# EAGLE design Lumen-Driver-X2 (EAGLE 7.4.0)
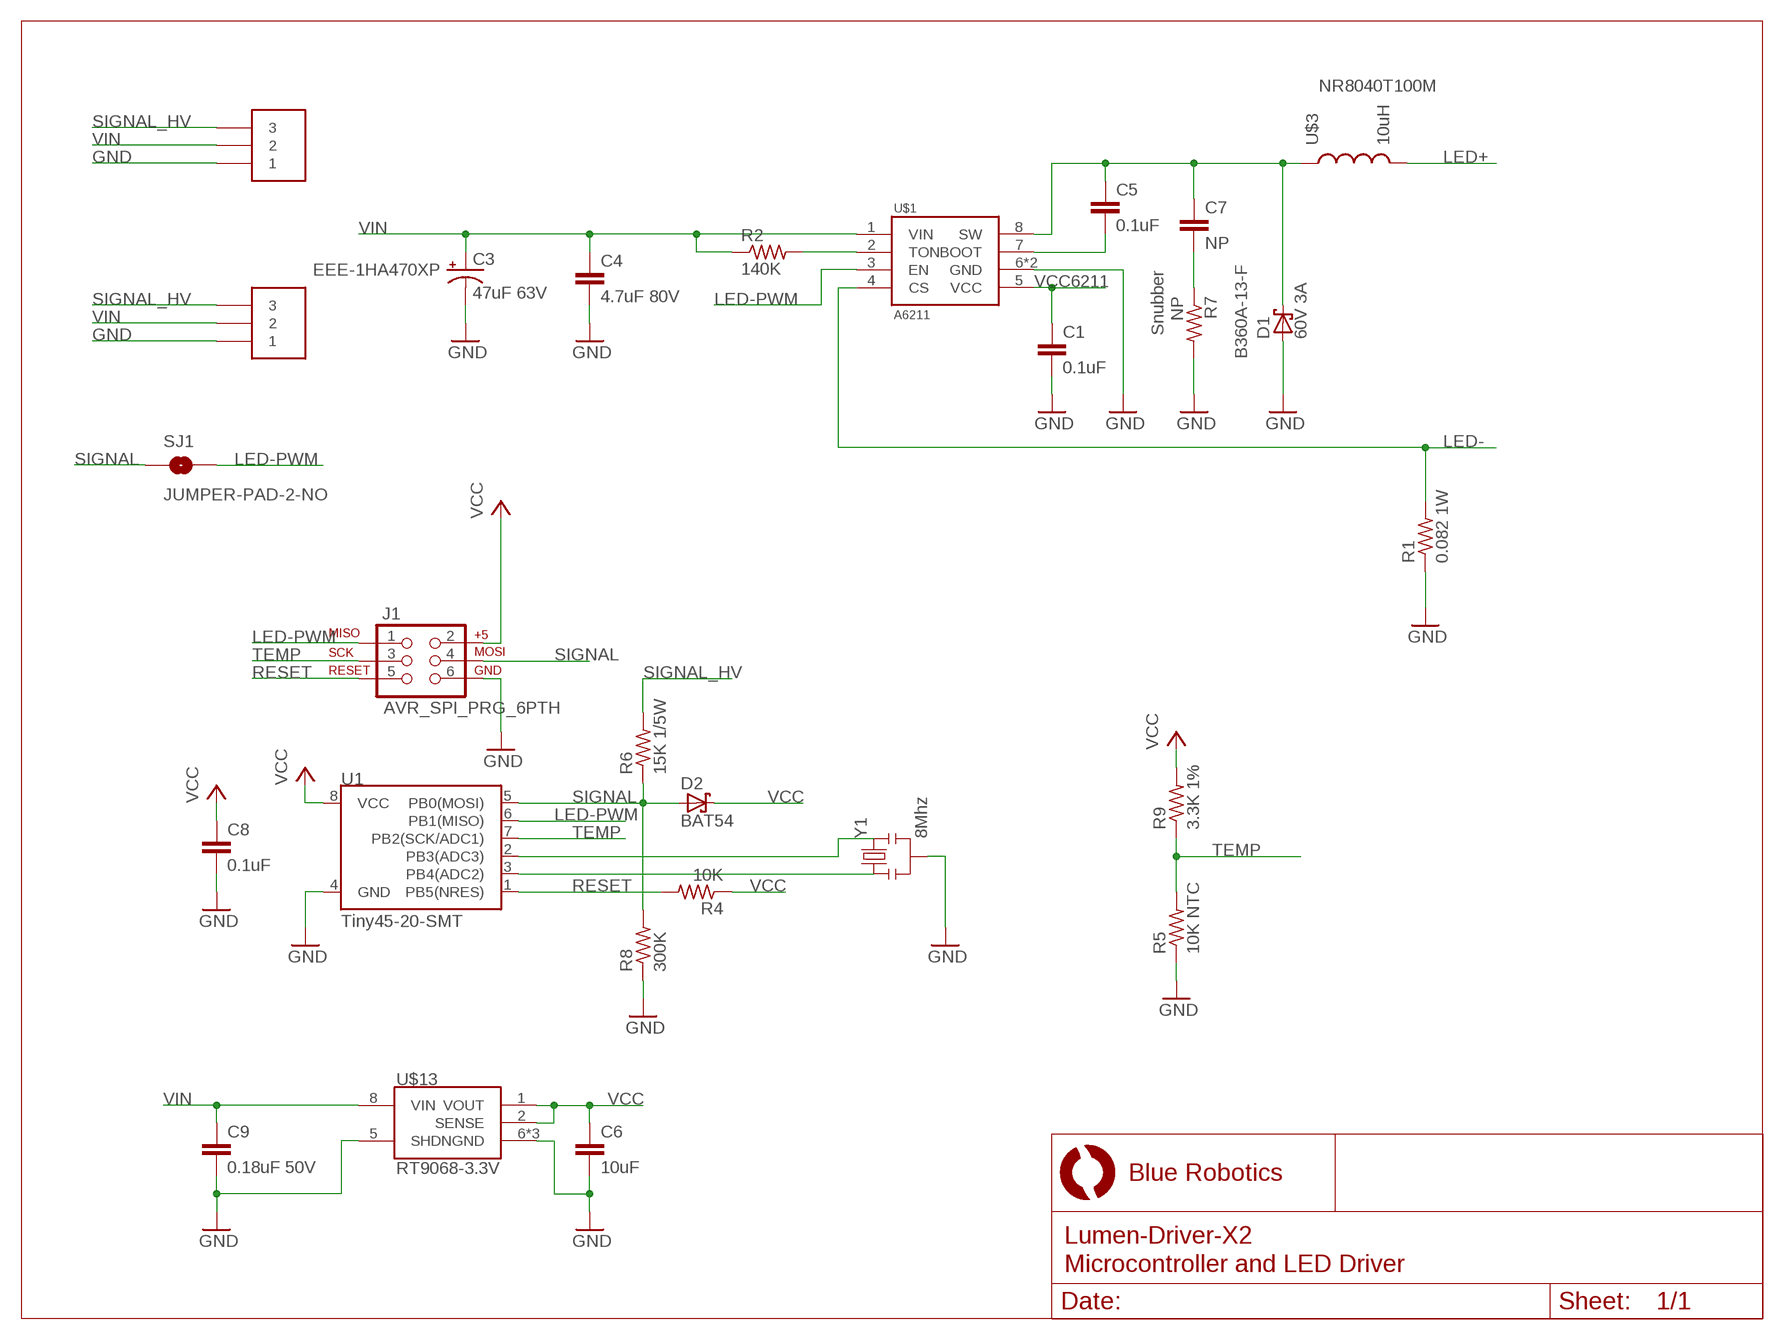
[diagram p0: schematic, sheet 1]

## Parts
C1  0.1uF  CAPACITOR_0402  [C0402]
C3  47uF 63V  CAP_POLD  [PANASONIC_D]
C4  4.7uF 80V  C-EUC1210  [C1210]
C5  0.1uF  CAPACITOR_0402  [C0402]
C6  10uF  C-EUC0603  [C0603]
C7  NP  C-EUC0603  [C0603]
C8  0.1uF  CAPACITOR_0402  [C0402]
C9  0.18uF 50V  C-EUC0805  [C0805]
D1  60V 3A  DIODE-SCHOTTKYSMA  [SMA]
D2  BAT54  DIODE-SCHOTTKYSOD523  [SOD523]
J1  AVR_SPI_PRG_6PTH  [2X3]
R1  0.082 1W  R-US_R2512  [R2512]
R2  140K  RESISTOR_0402  [R0402]
R4  10K  RESISTOR_0402  [R0402]
R5  10K NTC  R-US_R0603  [R0603]
R6  15K 1/5W  RESISTOR_0402  [R0402]
R7  NP  R-US_R1206  [R1206]
R8  300K  RESISTOR_0402  [R0402]
R9  3.3K 1%  RESISTOR_0402  [R0402]
SJ1  JUMPER-PAD-2-NO  [PAD-JUMPER-2-NO_NO_SILK]
U1  Tiny45-20-SMT  ATTINY45TINY45-20-SMT  [SO08-EIAJ]
U$1  A6211  [SOIC8N-LJ]
U$3  10uH  INDUCTOR8040  [INDUCTOR-8040]
U$11  009176003032006  HEADER-3AVX-9176  [AVX-9176-3POS]
U$12  009176003032006  HEADER-3AVX-9176  [AVX-9176-3POS]
U$13  RT9068-3.3V  VREG-RT9068SOP-8  [SOIC8N-LJ]
Y1  8Mhz  RESONATORSMD  [RESONATOR-SMD]

## Nets
GND: C1.2 C3.- C4.2 C6.2 C8.2 C9.2 D1.A J1.6 R1.1 R5.1 R7.2 R8.1 U1.4(GND) U$1.6(GND) U$1.PAD(GND) U$11.1 U$12.1 U$13.5(SHDN) U$13.6(GND) U$13.7(GND) U$13.PAD(GND) Y1.2
LED+: U$3.P$2
LED-: R1.2 U$1.4(CS)
LED-PWM: J1.1 SJ1.2 U1.6(PB1(MISO)) U$1.3(EN)
N$1: R2.2 U$1.2(TON)
N$2: C7.2 R7.1
N$4: C5.2 U$1.7(BOOT)
N$5: C5.1 C7.1 D1.C U$1.8(SW) U$3.P$1
N$6: U1.3(PB4(ADC2)) Y1.1
N$7: U1.2(PB3(ADC3)) Y1.3
RESET: J1.5 R4.2 U1.1(PB5(NRES))
SIGNAL: D2.A J1.4 R6.1 R8.2 SJ1.1 U1.5(PB0(MOSI))
SIGNAL_HV: R6.2 U$11.3 U$12.3
TEMP: J1.3 R5.2 R9.1 U1.7(PB2(SCK/ADC1))
VCC: C6.1 C8.1 D2.C J1.2 R4.1 R9.2 U1.8(VCC) U$13.1(VOUT) U$13.2(SENSE)
VCC6211: C1.1 U$1.5(VCC)
VIN: C3.+ C4.1 C9.1 R2.1 U$1.1(VIN) U$11.2 U$12.2 U$13.8(VIN)

## Notes on the sheet
- NR8040T100M
- EEE-1HA470XP
- Snubber
- B360A-13-F

## Library data of the parts
C1 C5 C8 = BlueRobotics-Main:CAPACITOR
C3 = SparkFun-Capacitors:CAP_POL: Capacitor Polarized These are standard SMD and PTH capacitors. Normally 10uF, 47uF, and 100uF in electrolytic and tantalum varieties. Always verify the external diameter of the through hole cap, it varies with capacity, voltage, and manufacturer. The EIA devices should be standard.
C4 C6 C7 C9 = resistor:C-EU: CAPACITOR, European symbol
D1 D2 = BlueRobotics-Main:DIODE-SCHOTTKY
J1 = SparkFun-Connectors:AVR_SPI_PRG_6: AVR ISP 6 Pin This is the reduced ISP connector for AVR programming. Common on Arduino. This footprint will take up less PCB space and can be used with a 10-pin to 6-pin adapter such as SKU: BOB-08508 **Special note about "TEST_POINT" package. The stop mask is on the top side, so if you want your programming test points to be on the bottom of your board, make sure to place this package on the bottom side of the board. This also ensure that the orientation to program from the bottom side will be correct.
R1 R5 R7 = resistor:R-US_: RESISTOR, American symbol
R2 R4 R6 R8 R9 = BlueRobotics-Main:RESISTOR
SJ1 = SparkFun-Passives:JUMPER-PAD-2-NO
U1 = SparkFun-DigitalIC:ATTINY45: Atmel 8-pin 2/4/8kB flash uC; PROD_ID: IC-08922
U$1 = BlueRobotics-Main:A6211
U$3 = BlueRobotics-Main:INDUCTOR
U$11 U$12 = BlueRobotics-Main:HEADER-3
U$13 = BlueRobotics-Main:VREG-RT9068: RT9068 60V to 3.3V Regulator, 50mA
Y1 = SparkFun:RESONATOR: Resonator Small SMD resonator. This is the itty bitty 10/20MHz resonators with built in caps. CSTCE10M0G55 and CSTCE20M0V53. Footprint has been reviewed closely but hasn't been tested yet.

## Board
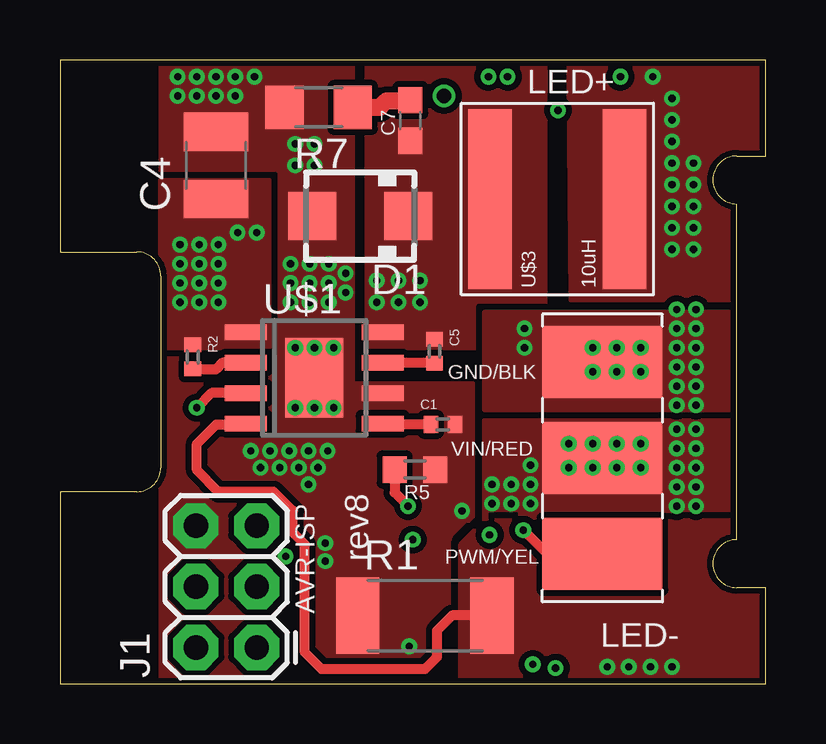
[diagram p1: board, top side]
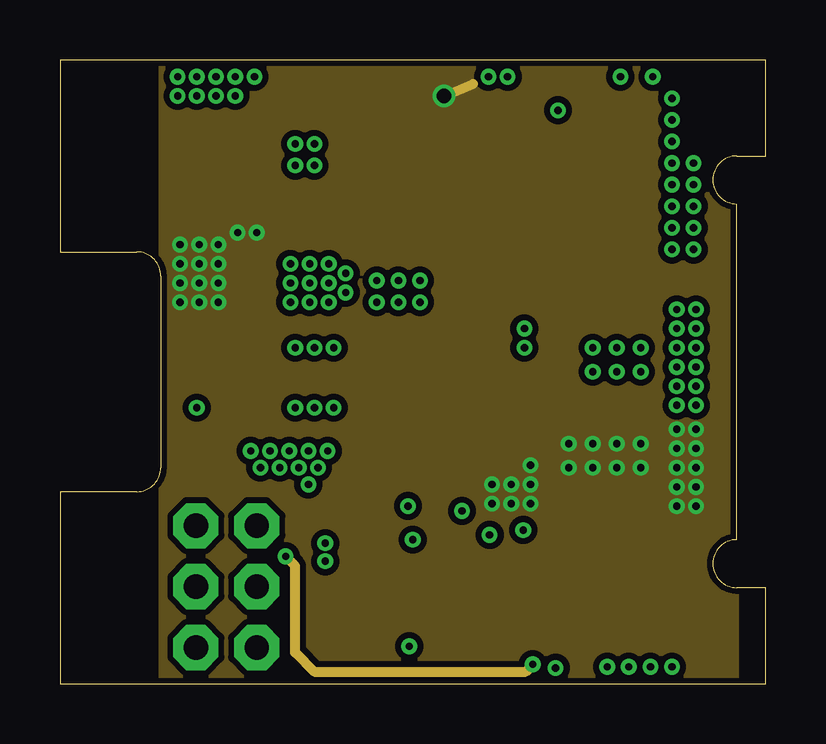
[diagram p2: board, inner layer Route2]
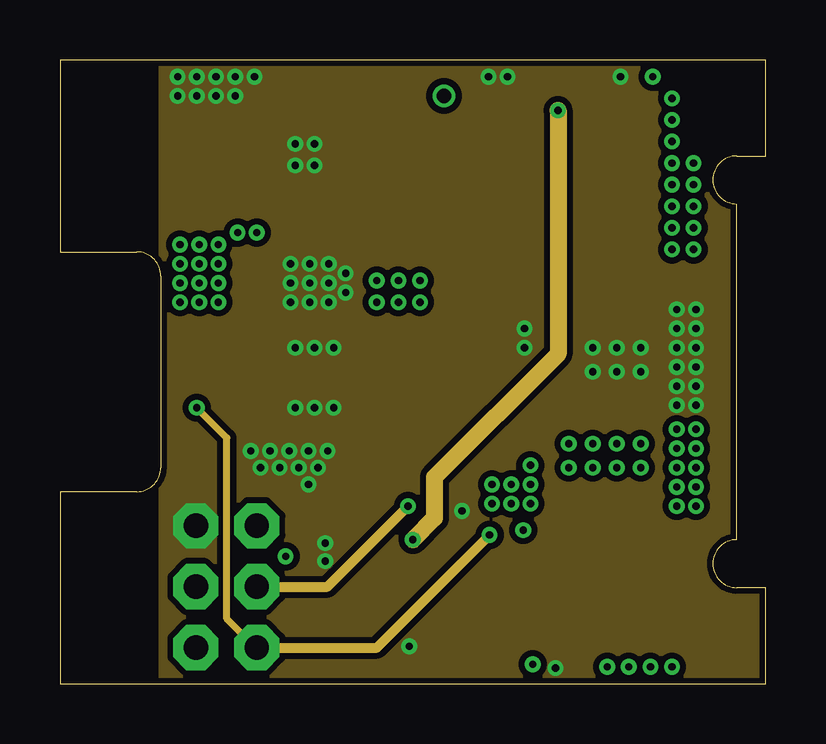
[diagram p3: board, inner layer Route15]
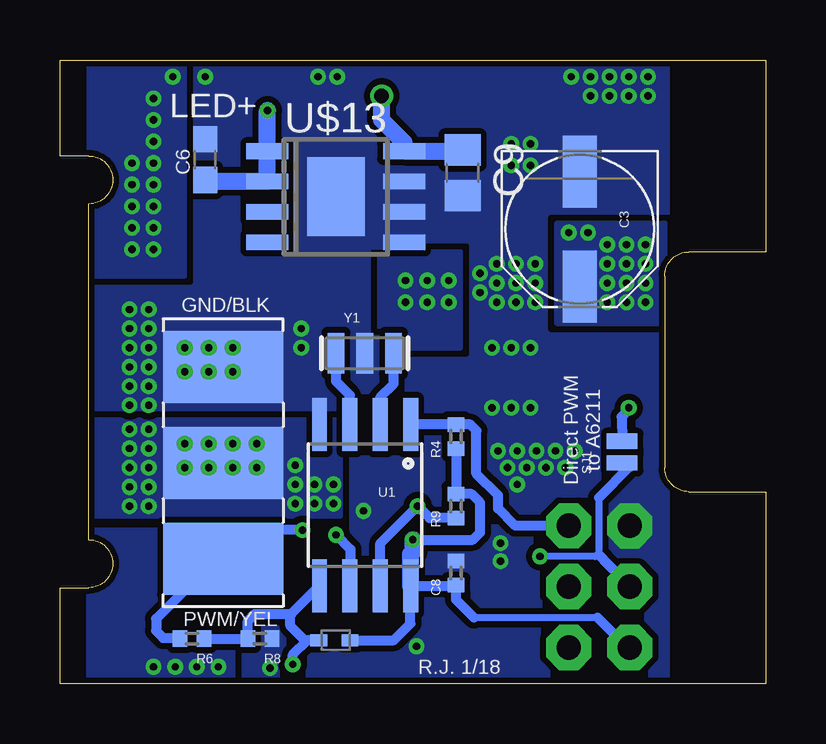
[diagram p4: board, bottom side, seen from below]

Size 29.4 x 26 mm. Coordinates in mm from the lower left corner, seen from the top.
Outline: 29.4,26 0,26 0,18 3.2,18 arc-90 4.2,17 4.2,9 arc-90 3.2,8 0,8 0,0 29.4,0 29.4,4 28.2,4 arc-180 28.2,6 28.2,20 arc-180 28.2,22 29.4,22 29.4,26
Copper layers (1*2+15*16): Top 0.0356mm / dielectric 1.5011mm / Route2 0.0356mm / dielectric 0.1499mm / Route15 0.0356mm / dielectric 0.2007mm / Bottom 0.0356mm
Design rules "OSHPark *": minimum track width 6mil, minimum drill 10mil, track to track 6mil, track to pad 6mil, pad to pad 6mil, via to via 6mil, smd to smd 6mil, copper to edge 10mil, drill to drill 6mil, minimum pad ring 7mil, minimum via ring 7mil, stop-mask expansion 3mil, vias tented up to drill 30mil, thermal gap 10mil

### Footprints (pad centres in the part's own frame; a part is rotated, then mirrored left to right if it is on the bottom)
C0402 = smd 0.6 x 0.7: 1 -0.5,0; 2 0.5,0
PANASONIC_D = smd 3 x 1.4: + 2.4,0; - -2.4,0
C1210 = smd 1.6 x 2.7: 1 -1.4,0; 2 1.4,0
C0603 = smd 1.1 x 1: 1 -0.85,0; 2 0.85,0
C0805 = smd 1.3 x 1.5: 1 -0.95,0; 2 0.95,0
SMA = smd 2 x 2: A 2,0; C -2,0
SOD523 = smd 0.7 x 0.5: A 0.7,0; C -0.6,0
2X3 = drill 1.016 pad 1.88 octagon: 1 0,0; 2 0,2.54; 3 2.54,0; 4 2.54,2.54; 5 5.08,0; 6 5.08,2.54
R2512 = smd 1.8 x 3.2: 1 -2.8,0; 2 2.8,0
R0402 = smd 0.6 x 0.7: 1 -0.5,0; 2 0.5,0
R0603 = smd 1 x 1.1: 1 -0.85,0; 2 0.85,0
R1206 = smd 1.6 x 1.803: 1 -1.422,0; 2 1.422,0
PAD-JUMPER-2-NO_NO_SILK = smd 0.635 x 1.27: 1 -0.45,0; 2 0.45,0
SO08-EIAJ = smd 0.61 x 2.21: 1 -1.905,-3.378; 2 -0.635,-3.378; 3 0.635,-3.378; 4 1.905,-3.378; 5 1.905,3.353; 6 0.635,3.353; 7 -0.635,3.353; 8 -1.905,3.353
SOIC8N-LJ = smd 0.65 x 1.75: 1 -1.9,-2.86; 2 -0.63,-2.86; 3 0.64,-2.86; 4 1.91,-2.86; 5 1.91,2.84; 6 0.64,2.84; 7 -0.63,2.84; 8 -1.9,2.84 | smd 3.3 x 2.41: PAD 0,0
INDUCTOR-8040 = smd 1.8 x 7.5: P$1 -2.8,0; P$2 2.8,0
AVX-9176-3POS = smd 3 x 5: 1 0,0; 2 4,0; 3 8,0
RESONATOR-SMD = smd 0.7 x 1.7: 1 -1.2,0; 2 0,0; 3 1.2,0

### Placement (x,y rotation side)
C1  15.95,10.8 0 top
C3  7.74,18.95 270 bottom
C4  6.5,21.6 90 top
C5  15.6,13.85 270 top
C6  23.35,21.85 90 bottom
C7  14.6,23.48 90 top
C8  12.9,4.6 90 bottom
C9  12.62,21.3 270 bottom
D1  12.51,19.49 180 top
D2  17.91,1.81 180 bottom
J1  8.2,1.5 90 top
R1  15.2,2.83 0 top
R2  5.53,13.62 270 top
R4  12.9,10.3 90 bottom
R5  14.79,8.93 180 top
R6  23.9,1.88 180 bottom
R7  10.78,24.02 180 top
R8  21.07,1.88 180 bottom
R9  12.9,7.4 90 bottom
SJ1  5.97,9.65 90 bottom
U1  16.69,7.42 180 bottom
U$1  10.6,12.75 270 top
U$3  20.72,20.2 0 top
U$11  22.6,13.4 270 top
U$12  22.6,13.2 270 bottom
U$13  17.9,20.3 270 bottom
Y1  16.7,13.78 0 bottom

### Tracks (layer width: path | path; a pad name or v marks a point on that pad's centre or on a via)
GND  (via drill 0.3)
  other vias: 9.6,15.9 25.7,11.6 26.5,11.6 26.5,12.4 26.5,13.2 26.5,14 26.5,14.8 26.5,15.6 25.7,12.4 25.7,13.2 25.7,14 25.7,14.8 25.7,15.6 4.9,25.3 5.7,25.3 6.5,25.3 7.3,25.3 8.1,25.3 4.9,24.5 5.7,24.5 6.5,24.5 7.3,24.5 9.8,22.5 10.6,22.5 10.6,21.6 9.8,21.6 9.6,16.7 9.6,17.5 10.4,17.5 11.2,17.5 10.4,16.7 10.4,15.9 11.2,15.9 11.2,16.7 11.9,17.1 11.9,16.3 9.55,9.7 9.8,14 11.4,14 10.6,14 11.4,11.5 10.6,11.5 9.8,11.5 10.35,9.7 11.15,9.7 9.95,9 10.75,9 11.05,5.1 10.35,8.3 11.05,5.85 8.75,9.7 7.95,9.7 9.15,9 8.35,9 20.65,0.65 19.35,14.8 19.35,14 17.85,25.3 23.35,25.3 22.2,13 22.2,14 23.2,14 24.2,14 24.2,13 23.2,13 18.65,25.3 16.75,7.2 14.55,1.55
  pour Top (isolate 0.254, rank 6, no thermals): 4.2,27 4.2,-1 16.2,-1 16.2,6 17.2,7 17.2,12.5 12.2,12.5 12.2,27
  pour Top (isolate 0.254, no thermals): 17.7,11.4 17.7,15.5 28.2,15.5 28.2,11.4
  pour Bottom (isolate 0.254, rank 6, no thermals): 4.2,-1 28.2,-1 28.2,27 4.2,27
  pour Route15 (isolate 0.254, rank 6, no thermals): 4.2,-1 29.2,-1 29.2,27 4.2,27
LED+  (via drill 0.3)
  other vias: 24.7,25.3 26.4,21.7 26.4,20.8 26.4,19.9 26.4,19 26.4,18.1 25.5,18.1 25.5,19 25.5,19.9 25.5,20.8 25.5,21.7 25.5,22.6 25.5,23.5 25.5,24.4
  pour Top (isolate 0.254, no thermals): 21.3,16 21.2,27 31.2,27 31.2,16
  pour Bottom (isolate 0.254, no thermals): 24.2,27 28.2,27 28.2,17 24.2,17
LED-  (via drill 0.3)
  Top 0.406: R1.2 16.34,2.83 15.7,2.2 15.7,1.1 15.2,0.6 10.9,0.6 10.2,1.3 10.2,5.8 9.7,6.3 9.7,7.2 8.9,8 6.6,8 5.7,8.9 5.7,10 6.5,10.8 7.7,10.8 U$1.4
  other vias: 22.8,0.7 23.7,0.7 24.6,0.7 25.5,0.7
  pour Top (isolate 0.254, no thermals): 17.7,6.8 31.2,6.8 31.2,-1 16.7,-1 16.7,5.8
  pour Bottom (isolate 0.254, no thermals): 22.2,-1 28.2,-1 28.2,6.4 22.2,6.4
LED-PWM  (via drill 0.3)
  Top 0.406: U$1.3 6.31,12.11 v5.7,11.5
  Route15 0.3: J1.1 8.15,1.5 6.95,2.7 6.95,10.25 v5.7,11.5
  Route15 0.406: J1.1 13.2,1.5 v17.9,6.2
  Bottom 0.406: v17.9,6.2 17.3,5.6 17.3,4.09 U1.6 | v5.7,11.5 6,11.12 SJ1.2
N$1
  Top 0.406: U$1.2 6.78,13.38 6.5,13.1 5.66,13.1 R2.2
N$2
  Top 0.7: R7.1 13.32,24.02 13.6,24.3 14.57,24.3 C7.2
N$4
  Top 0.406: U$1.7 15.6,13.38 C5.2
N$5  (via drill 0.3)
  other vias: 13.2,15.9 13.2,16.8 14.1,16.8 15,16.8 14.1,15.9 15,15.9
  pour Top (isolate 0.254, rank 2, no thermals): 12.8,14 12.8,27 20.2,27 20.2,14
  pour Bottom (isolate 0.254, no thermals): 12.7,14 12.7,18 16.1,18 16.1,14
N$6
  Bottom 0.406: U1.3 17.32,12.03 17.9,12.6 Y1.1
N$7
  Bottom 0.406: U1.2 16.05,11.95 15.5,12.5 Y1.3
RESET
  Bottom 0.406: J1.5 10.43,6.58 11.15,7.3 11.15,7.85 12.05,8.75 12.05,10.55 12.3,10.8 R4.2 U1.1
SIGNAL  (via drill 0.3)
  Route2 0.406: v19.7,0.8 19.4,0.5 10.6,0.5 9.8,1.3 9.8,4.9 v9.4,5.3
  Bottom 0.3: 6.95,7.75 6.95,5.38 7.02,5.38 7.1,5.3 v9.4,5.3
  Bottom 0.406: R6.1 R8.2 21.57,2.62 21.3,2.9 19.76,2.9 | 19.76,2.9 U1.5 | D2.A 19.1,1.81 | 19.1,1.81 19.21,1.81 19.8,2.4 19.8,2.86 19.76,2.9 | SJ1.1 5.67,9.03 6.95,7.75 | 6.95,5.38 J1.4 | v19.7,0.8 19.7,1.21 19.1,1.81
SIGNAL_HV  (via drill 0.3)
  Top 0.406: U$11.3 20.3,5.4 v19.3,6.4
  Bottom 0.406: v19.3,6.4 21.4,6.4 U$12.3 22.9,5.2 25.4,2.7 25.4,2.2 25.1,1.9 24.43,1.9 R6.2
TEMP  (via drill 0.3)
  Top 0.406: R5.2 13.94,7.96 v14.5,7.4
  Route15 0.406: J1.3 11.14,4.04 v14.5,7.4
  Bottom 0.406: R9.1 14,6.9 v14.5,7.4 16.05,5.84 U1.7
VCC  (via drill 0.3)
  Route15 0.7: v20.75,23.9 20.75,13.75 15.6,8.6 15.6,6.9 v14.7,6
  Bottom 0.3: J1.2 5.75,1.5 | 7,2.75 12.15,2.75
  Bottom 0.406: R4.1 R9.2 12.25,7.9 11.9,7.55 11.9,6.3 12.2,6 v14.7,6 | D2.C 15.49,1.81 14.8,2.5 14.8,4.05 U1.8 12.93,4.07 C8.1 12.9,3.5 12.15,2.75 | 5.75,1.5 7,2.75
  Bottom 0.7: U$13.2 23.48,20.93 C6.1 | U$13.2 U$13.1 | U$13.2 v20.76,23.89 v20.75,23.9 | v14.7,6 14.7,5.5 14.8,5.4 14.8,4.08 U1.8
VCC6211
  Top 0.406: C1.1 13.48,10.8 U$1.5
VIN  (via drill 0.3, 0.6)
  Route2 0.406: v16,24.5 17.2,25
  Bottom 0.7: 16,24.6 v16,24.5 16,23.5 15.06,22.56 U$13.8 12.78,22.2 C9.1
  other vias: 25.7,10.6 25.7,9.8 25.7,9 25.7,8.2 25.7,7.4 26.5,7.4 26.5,8.2 26.5,9 26.5,9.8 26.5,10.6 5,15.9 5,16.7 5,17.5 5.8,15.9 6.6,15.9 6.6,18.3 6.6,16.7 5.8,16.7 5.8,17.5 6.6,17.5 5,18.3 5.8,18.3 19.6,7.5 19.6,8.3 18.8,8.3 18.8,7.5 18,7.5 18,8.3 19.6,9.1 21.2,10 21.2,9 22.2,9 23.2,9 24.2,9 24.2,10 23.2,10 22.2,10 7.4,18.8 8.2,18.8
  pour Top (isolate 0.254, no thermals): 4.2,21 8.7,21 8.7,14 4.2,14
  pour Route2 (isolate 0.254, no thermals): 28.2,0 28.2,27 4.2,27 4.2,0
  pour Top (isolate 0.254, rank 2, no thermals): 17.7,11 28.2,11 28.2,6.5 17.7,6.5
  pour Bottom (isolate 0.254, no thermals): 4.2,15 8.7,15 8.7,19.2 4.2,19.2
  pour Bottom (isolate 0.254, no thermals): 17.7,11 28.2,11 28.2,7 17.7,7

### Text on the board
tPlace: LED+ | GND/BLK | VIN/RED | rev8 | PWM/YEL | AVR-ISP | LED-
bPlace: LED+ | GND/BLK | Direct PWM / to A6211 | PWM/YEL | R.J. 1/18